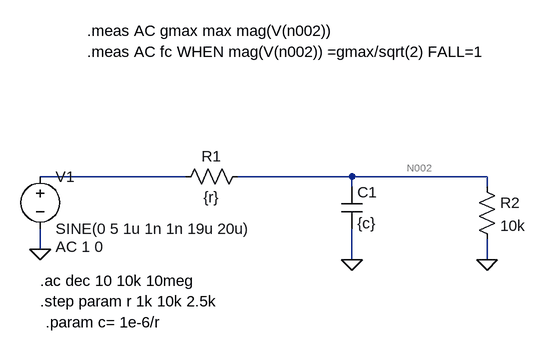
[diagram p0: schematic quiz_q7.asc]
quiz_q7.asc, the LTspice schematic file:
Version 4
SHEET 1 880 680
WIRE 352 80 128 80
WIRE 608 80 432 80
WIRE 816 80 608 80
WIRE 608 96 608 80
WIRE 816 96 816 80
WIRE 128 192 128 160
WIRE 608 208 608 160
WIRE 816 208 816 176
FLAG 128 192 0
FLAG 608 208 0
FLAG 816 208 0
SYMBOL voltage 128 64 R0
WINDOW 123 24 124 Left 2
WINDOW 39 0 0 Left 0
SYMATTR Value2 AC 1 0
SYMATTR InstName V1
SYMATTR Value SINE(0 5 1u 1n 1n 19u 20u)
SYMBOL res 448 64 R90
WINDOW 0 0 56 VBottom 2
WINDOW 3 32 56 VTop 2
SYMATTR InstName R1
SYMATTR Value {r}
SYMBOL cap 592 96 R0
SYMATTR InstName C1
SYMATTR Value {c}
SYMBOL res 800 80 R0
SYMATTR InstName R2
SYMATTR Value 10k
TEXT 128 240 Left 2 !.ac dec 10 10k 10meg
TEXT 128 272 Left 2 !.step param r 1k 10k 2.5k
TEXT 136 304 Left 2 !.param c= 1e-6/r
TEXT 200 -144 Left 2 !.meas AC gmax max mag(V(n002))
TEXT 200 -112 Left 2 !.meas AC fc WHEN mag(V(n002)) =gmax/sqrt(2) FALL=1

The netlist it stands for:
* quiz_q7.asc
V1 N001 0 SINE(0 5 1u 1n 1n 19u 20u) AC 1 0
R1 N002 N001 {r}
C1 N002 0 {c}
R2 N002 0 10k
.ac dec 10 10k 10meg
.step param r 1k 10k 2.5k
.param c= 1e-6/r
.meas AC gmax max mag(V(n002))
.meas AC fc WHEN mag(V(n002)) =gmax/sqrt(2) FALL=1
.backanno
.end

* Results of the author's LTspice run, read from the files saved beside the schematic
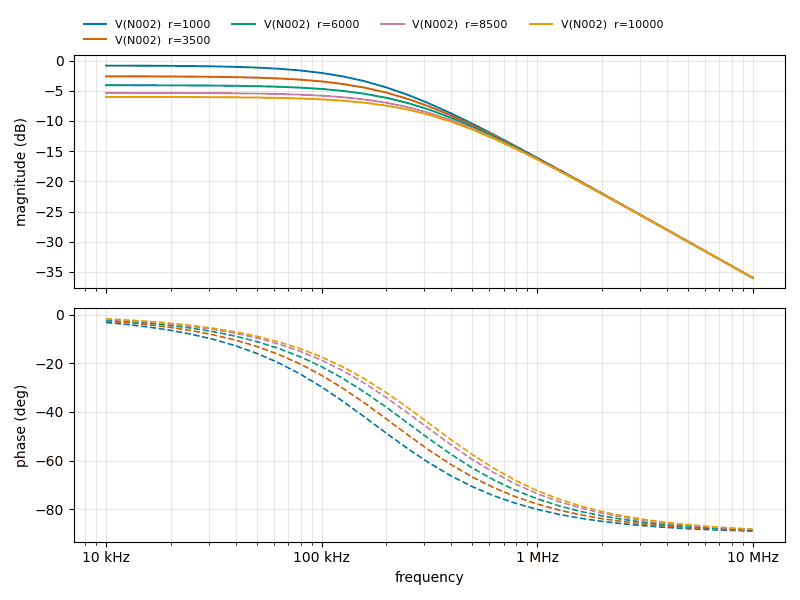
[diagram p1: AC Analysis of quiz_q7.asc, plotted from the saved traces]
* AC Analysis, 5 runs:
*   V(N002) [r=1000]: -0.84 dB at 10 kHz, -35.96 dB at 10 MHz, peak -0.84 dB at 10 kHz, 3 dB below the peak at 174.5 kHz
*   V(N002) [r=3500]: -2.62 dB at 10 kHz, -35.97 dB at 10 MHz, peak -2.62 dB at 10 kHz, 3 dB below the peak at 214.1 kHz
*   V(N002) [r=6000]: -4.09 dB at 10 kHz, -35.97 dB at 10 MHz, peak -4.09 dB at 10 kHz, 3 dB below the peak at 254.7 kHz
*   V(N002) [r=8500]: -5.35 dB at 10 kHz, -35.97 dB at 10 MHz, peak -5.35 dB at 10 kHz, 3 dB below the peak at 293.1 kHz
*   V(N002) [r=10000]: -6.02 dB at 10 kHz, -35.97 dB at 10 MHz, peak -6.02 dB at 10 kHz, 3 dB below the peak at 318.4 kHz
* From the log:
*   Measurement: gmax
*     step  MAX(mag(v(n002)))  FROM  TO
*        1  (-0.842dB,0°)  10000  1e+07
*        2  (-2.61607dB,0°)  10000  1e+07
*        3  (-4.08909dB,0°)  10000  1e+07
*        4  (-5.34844dB,0°)  10000  1e+07
*        5  (-6.02488dB,0°)  10000  1e+07
*   Measurement: fc
*     step  mag(v(n002))=gmax/sqrt(2)
*        1  176241
*        2  216024
*        3  255306
*        4  295519
*        5  318797